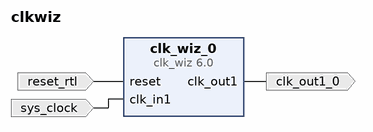
[diagram p0: block diagram of the top level]
# Vivado block design clkwiz, xc7z020clg400-1, Vivado 2018.3
create_bd_design clkwiz

create_bd_port -dir I -type rst reset_rtl
set_property -dict {CONFIG.POLARITY ACTIVE_HIGH} [get_bd_ports reset_rtl]
create_bd_port -dir I -type clk sys_clock
set_property -dict {CONFIG.FREQ_HZ 125000000 CONFIG.PHASE 0.000} [get_bd_ports sys_clock]
create_bd_port -dir O -type clk clk_out1_0

create_bd_cell -type ip -vlnv xilinx.com:ip:clk_wiz:6.0 clk_wiz_0
set_property -dict [list \
  CONFIG.CLKOUT1_JITTER 198.332 \
  CONFIG.CLKOUT1_PHASE_ERROR 95.839 \
  CONFIG.CLKOUT1_REQUESTED_OUT_FREQ 9.000 \
  CONFIG.CLK_IN1_BOARD_INTERFACE sys_clock \
  CONFIG.MMCM_CLKFBOUT_MULT_F 7.875 \
  CONFIG.MMCM_CLKOUT0_DIVIDE_F 109.375 \
  CONFIG.MMCM_DIVCLK_DIVIDE 1 \
  CONFIG.USE_BOARD_FLOW true \
  CONFIG.USE_CLKFB_STOPPED false \
  CONFIG.USE_LOCKED false \
] [get_bd_cells clk_wiz_0]

# ---- connections ----

connect_bd_net [get_bd_ports reset_rtl] [get_bd_pins clk_wiz_0/reset]
connect_bd_net [get_bd_ports sys_clock] [get_bd_pins clk_wiz_0/clk_in1]
connect_bd_net [get_bd_pins clk_wiz_0/clk_out1] [get_bd_ports clk_out1_0]

validate_bd_design
save_bd_design
